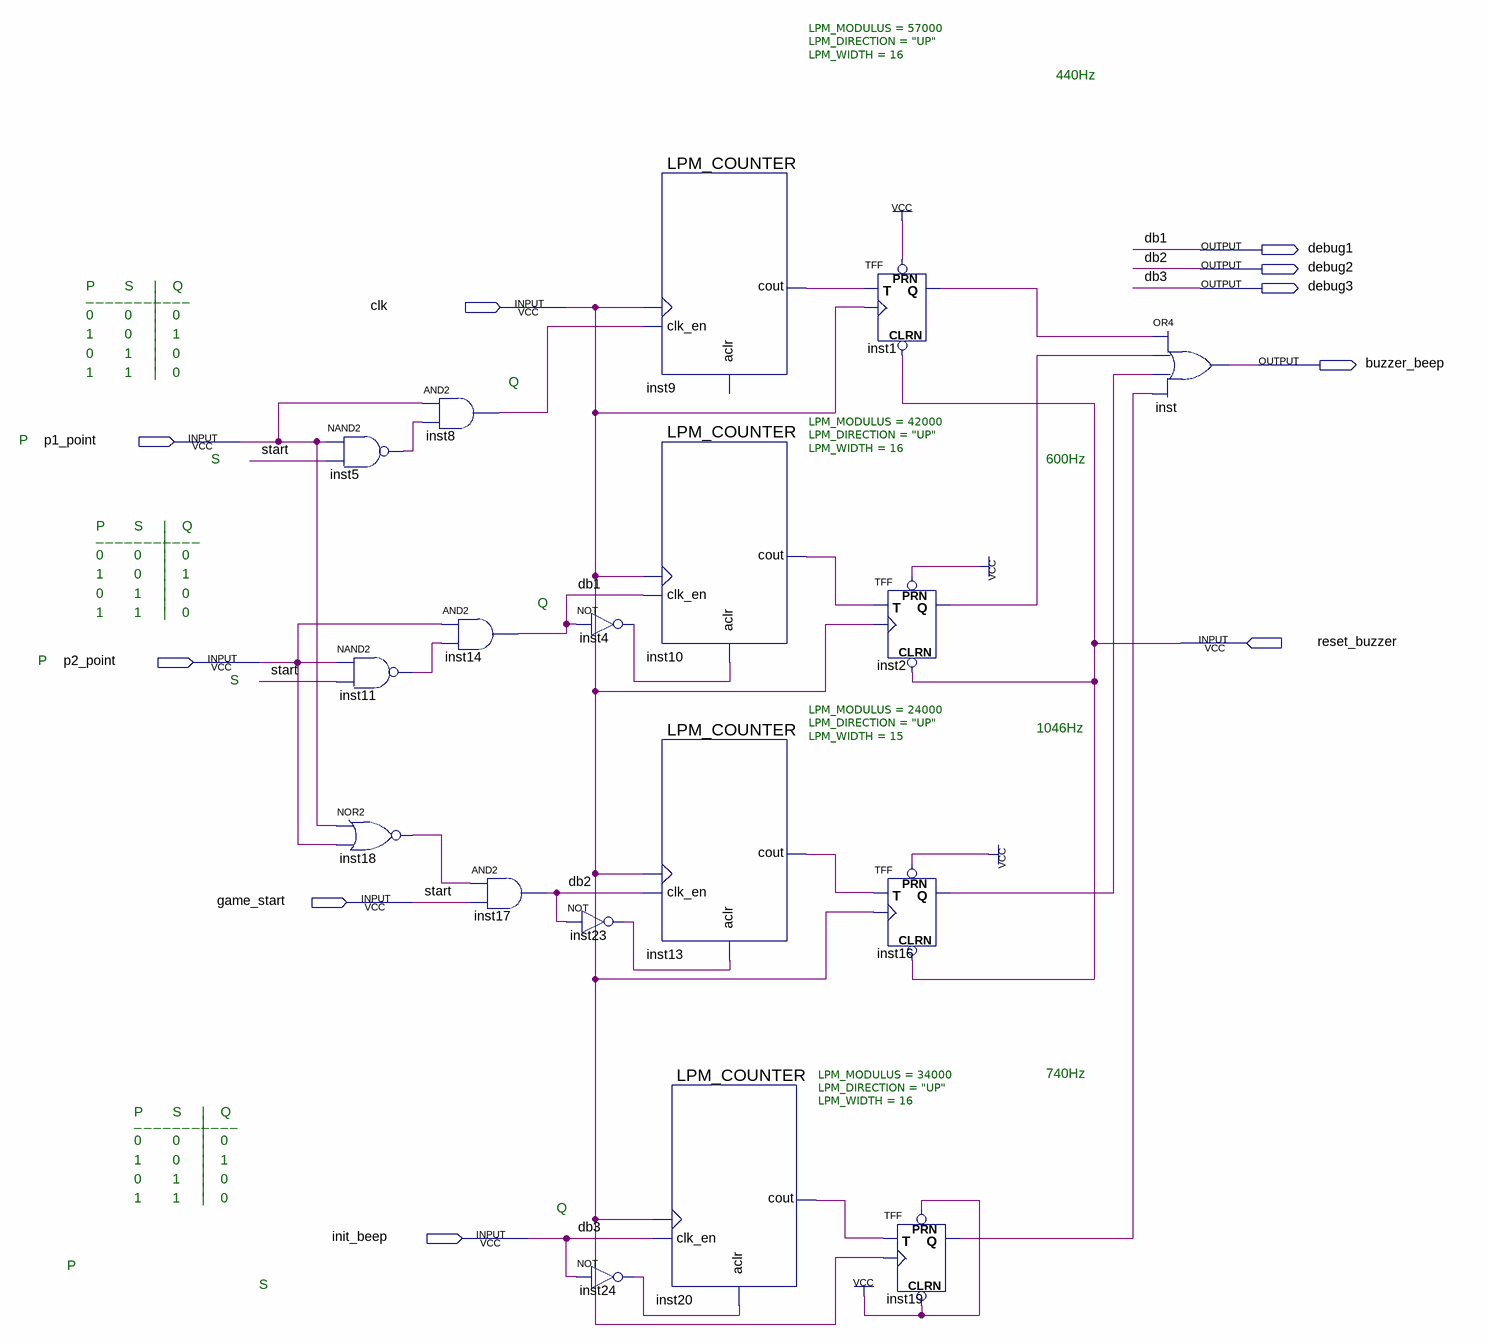
[diagram p0: schematic sheet]
// Quartus schematic buzzer.bdf as structural Verilog: 18 symbols, 10 pins
module buzzer (
  input  clk,
  input  p1_point,
  input  reset_buzzer,
  input  p2_point,
  input  game_start,
  input  init_beep,
  output debug1,
  output debug2,
  output debug3,
  output buzzer_beep
);

  wire inst1_q, inst2_q, inst4_out, inst5_out, inst8_out, inst9_cout, inst10_cout, inst11_out, inst13_cout,
       inst16_q, inst18_out, inst19_q, inst20_cout, inst23_out, inst24_out;

  nand inst5 (inst5_out, p1_point, game_start);
  nand inst11 (inst11_out, p2_point, game_start);
  nor inst18 (inst18_out, p1_point, p2_point);
  and inst8 (inst8_out, p1_point, inst5_out);
  and inst14 (debug1, p2_point, inst11_out);
  and inst17 (debug2, inst18_out, game_start);
  not inst4 (inst4_out, debug1);
  not inst23 (inst23_out, debug2);
  not inst24 (inst24_out, init_beep);
  LPM_COUNTER #(.LPM_MODULUS(57000), .LPM_DIRECTION("UP"), .LPM_WIDTH(16)) inst9 (
    .clk_en(inst8_out), .clock(clk), .cout(inst9_cout));  // open: aclr
  LPM_COUNTER #(.LPM_MODULUS(42000), .LPM_DIRECTION("UP"), .LPM_WIDTH(16)) inst10 (
    .aclr(inst4_out), .clk_en(debug1), .clock(clk), .cout(inst10_cout));
  LPM_COUNTER #(.LPM_MODULUS(24000), .LPM_DIRECTION("UP"), .LPM_WIDTH(15)) inst13 (
    .aclr(inst23_out), .clk_en(debug2), .clock(clk), .cout(inst13_cout));
  LPM_COUNTER #(.LPM_MODULUS(34000), .LPM_DIRECTION("UP"), .LPM_WIDTH(16)) inst20 (
    .aclr(inst24_out), .clk_en(init_beep), .clock(clk), .cout(inst20_cout));
  TFF inst1 (.PRN(1'b1), .CLRN(reset_buzzer), .T(inst9_cout), .CLK(clk), .Q(inst1_q));
  TFF inst2 (.PRN(1'b1), .CLRN(reset_buzzer), .T(inst10_cout), .CLK(clk), .Q(inst2_q));
  TFF inst16 (.PRN(1'b1), .CLRN(reset_buzzer), .T(inst13_cout), .CLK(clk), .Q(inst16_q));
  TFF inst19 (.PRN(1'b1), .CLRN(1'b1), .T(inst20_cout), .CLK(clk), .Q(inst19_q));
  or inst (buzzer_beep, inst1_q, inst2_q, inst16_q, inst19_q);

  assign debug3 = init_beep;

  // Other names for the same wires on the sheet: db1 = debug1; db2 = debug2; db3 = init_beep; start = game_start

  // Notes on the sheet:
  //   440Hz
  //   P
  //   S
  //   |
  //   Q
  //   _
  //   _
  //   _
  //   _
  //   _
  //   _
  //   _
  //   _
  //   |
  //   _
  //   _
  //   _
  //   |
  //   0
  //   0
  //   |
  //   0
  //   |
  //   1
  //   0
  //   |
  //   1
  //   |
  //   0
  //   1
  //   |
  //   0
  //   |
  //   1
  //   1
  //   |
  //   0
  //   Q
  //   P
  //   S
  //   600Hz
  //   P
  //   S
  //   |
  //   Q
  //   _
  //   _
  //   _
  //   _
  //   _
  //   _
  //   _
  //   _
  //   |
  //   _
  //   _
  //   _
  //   |
  //   0
  //   0
  //   |
  //   0
  //   |
  //   1
  //   0
  //   |
  //   1
  //   |
  //   0
  //   1
  //   |
  //   0
  //   |
  //   Q
  //   1
  //   1
  //   |
  //   0
  //   P
  //   S
  //   1046Hz
  //   740Hz
  //   P
  //   S
  //   |
  //   Q
  //   _
  //   _
  //   _
  //   _
  //   _
  //   _
  //   _
  //   _
  //   |
  //   _
  //   _
  //   _
  //   |
  //   0
  //   0
  //   |
  //   0
  //   |
  //   1
  //   0
  //   |
  //   1
  //   |
  //   0
  //   1
  //   |
  //   0
  //   |
  //   1
  //   1
  //   |
  //   0
  //   Q
  //   P
  //   S
endmodule
